# EAGLE schematic temp (EAGLE 8.7.0)
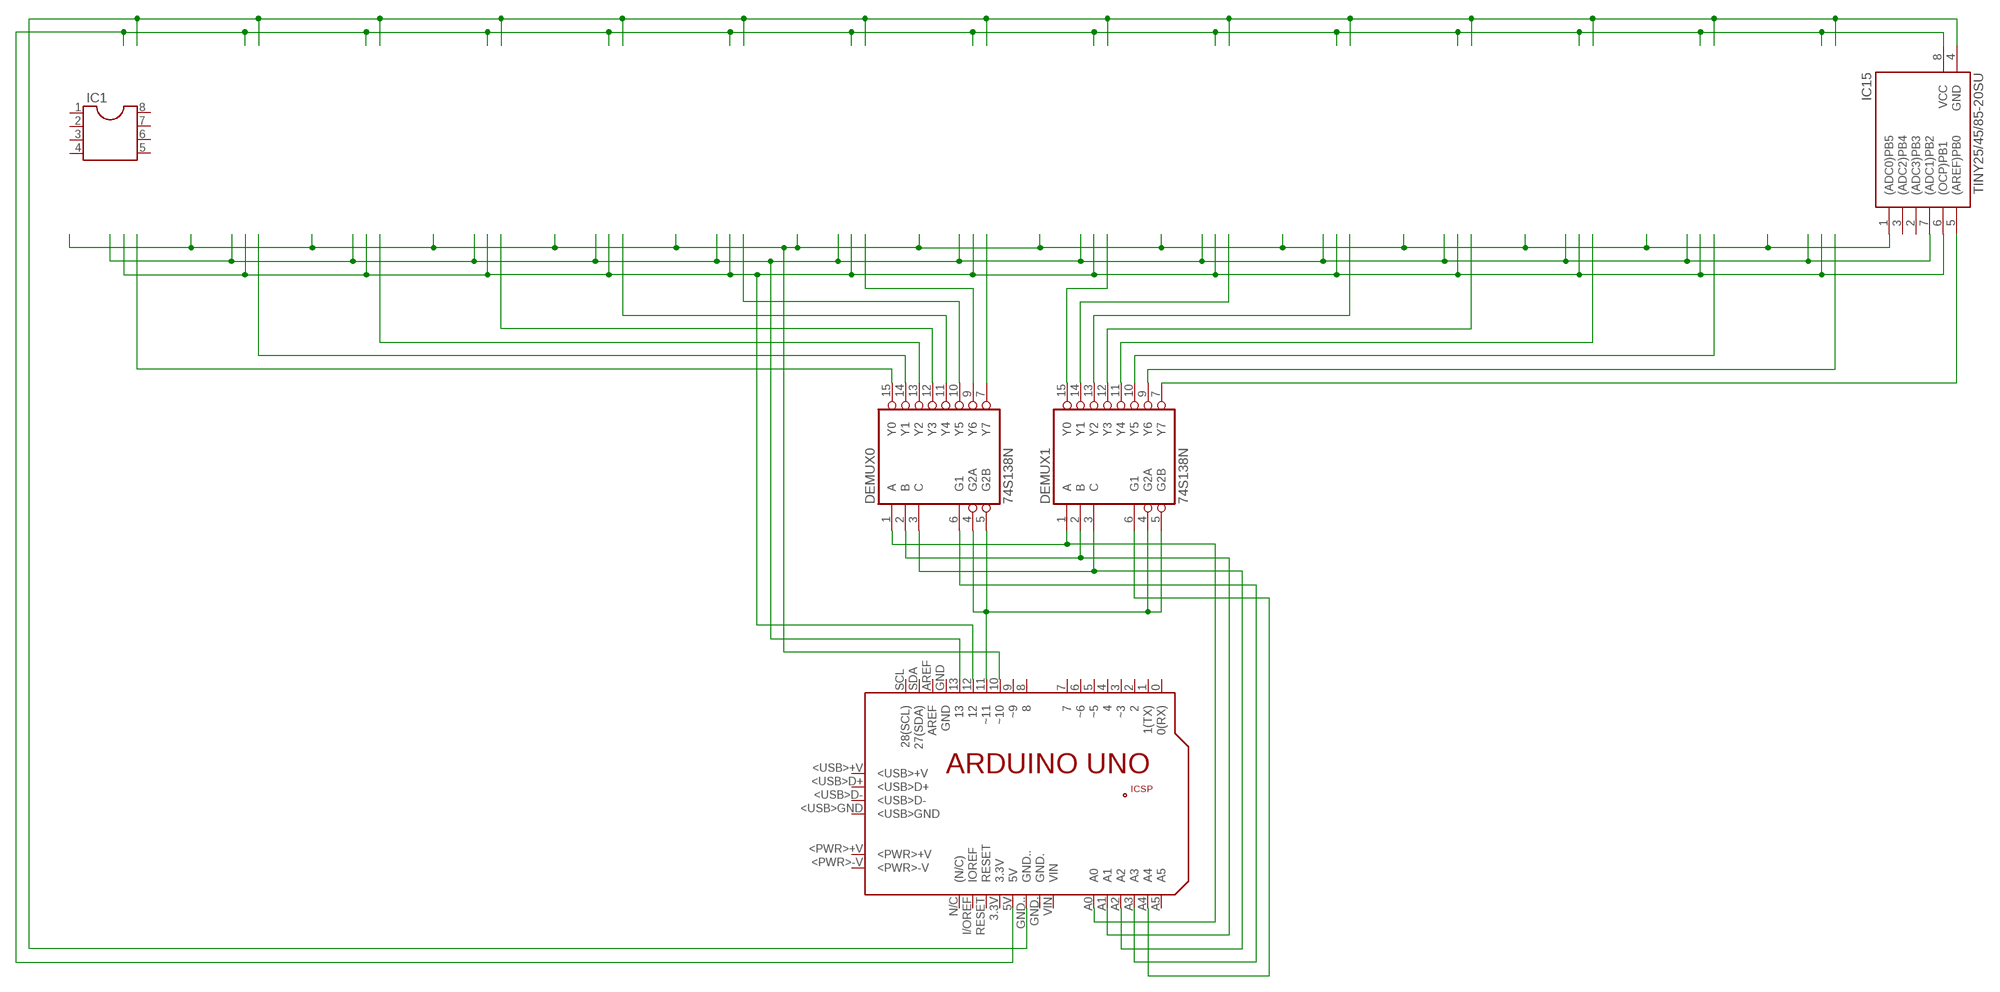
[diagram p0: schematic, sheet 1]

## Parts
DEMUX0  74S138N  [DIL16]
DEMUX1  74S138N  [DIL16]
IC1  DIL8  [DIL08]
IC15  TINY25/45/85-20SU  [SOIC8]
PCB1  ARDUINO_UNO  [ARDUINO_UNO]

## Nets
A: DEMUX0.1(A) DEMUX1.1(A) PCB1.A0
B: DEMUX0.2(B) DEMUX1.2(B) PCB1.A1
C: DEMUX0.3(C) DEMUX1.3(C) PCB1.A2
D: DEMUX0.6(G1) PCB1.A3
D': DEMUX1.6(G1) PCB1.A4
GND: IC15.4(GND) PCB1.GND..
MISO: IC15.6((OCP)PB1) PCB1.12
MOSI00: DEMUX0.15(Y0)
MOSI01: DEMUX0.14(Y1)
MOSI02: DEMUX0.13(Y2)
MOSI03: DEMUX0.12(Y3)
MOSI04: DEMUX0.11(Y4)
MOSI05: DEMUX0.10(Y5)
MOSI06: DEMUX0.9(Y6)
MOSI07: DEMUX0.7(Y7)
MOSI08: DEMUX1.15(Y0)
MOSI09: DEMUX1.14(Y1)
MOSI10: DEMUX1.13(Y2)
MOSI11: DEMUX1.12(Y3)
MOSI12: DEMUX1.11(Y4)
MOSI13: DEMUX1.10(Y5)
MOSI14: DEMUX1.9(Y6)
MOSI15: DEMUX1.7(Y7) IC15.5((AREF)PB0)
N$30: DEMUX0.4(G2A) DEMUX0.5(G2B) DEMUX1.4(G2A) DEMUX1.5(G2B) PCB1.11(~11)
RST: IC15.1((ADC0)PB5) PCB1.10(~10)
SCK: IC15.7((ADC1)PB2) PCB1.13
VCC: IC15.8(VCC) PCB1.5V
Unconnected: IC1.1 IC1.2 IC1.3 IC1.4 IC1.5 IC1.6 IC1.7 IC1.8 IC15.2((ADC3)PB3) IC15.3((ADC2)PB4) PCB1.0(0(RX)) PCB1.1(1(TX)) PCB1.2 PCB1.3(~3) PCB1.3.3V PCB1.4 PCB1.5(~5) PCB1.6(~6) PCB1.7 PCB1.8 PCB1.9(~9) PCB1.+5V PCB1.<PWR>+V PCB1.<PWR>-V PCB1.<USB>+V PCB1.<USB>D+ PCB1.<USB>D- PCB1.<USB>GND PCB1.A5 PCB1.AREF PCB1.GND PCB1.GND. PCB1.GND_ PCB1.I/OREF(IOREF) PCB1.MISO PCB1.MOSI PCB1.N/C((N/C)) PCB1.RESET PCB1.RESET. PCB1.SCK PCB1.SCL(28(SCL)) PCB1.SDA(27(SDA)) PCB1.VIN

## Power pins joined to a net without a drawn wire
GND: DEMUX0.8(GND) DEMUX1.8(GND)
VCC: DEMUX0.16(VCC) DEMUX1.16(VCC)

## Library data of the parts
DEMUX0 DEMUX1 = 74xx-eu:74*138: 3-line to 8-line DECODER/DEMULTIPLEXER
IC1 = ic-package:DIL8: Dual In Line / Socket
IC15 = avr-7:TINY25/45/85
PCB1 = E14_Arduino_revC:ARDUINO_UNO: Device for representing an Arduino Uno board with a footprint in an EAGLE design. Created by Dave Young for Element14. More EAGLE documentation at: http://www.element14.com/community/community/knode/cadsoft_eagle